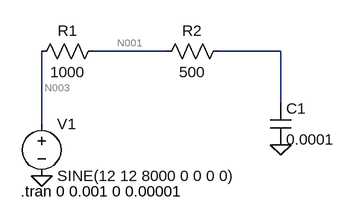
[diagram p0: schematic test_LV.asc]
test_LV.asc, the LTspice schematic file:
Version 4
SHEET 1 924 680
WIRE 464 -48 352 -48
WIRE 640 -48 544 -48
WIRE 640 32 640 -48
WIRE 272 64 272 -48
FLAG 640 96 0
FLAG 272 144 0
SYMBOL res 368 -64 R90
WINDOW 0 0 56 VBottom 2
WINDOW 3 32 56 VTop 2
SYMATTR InstName R1
SYMATTR Value 1000
SYMBOL res 560 -64 R90
WINDOW 0 0 56 VBottom 2
WINDOW 3 32 56 VTop 2
SYMATTR InstName R2
SYMATTR Value 500
SYMBOL cap 624 32 R0
SYMATTR InstName C1
SYMATTR Value 0.0001
SYMBOL voltage 272 48 R0
WINDOW 123 0 0 Left 0
WINDOW 39 0 0 Left 0
SYMATTR InstName V1
SYMATTR Value SINE(12 12 8000 0 0 0 0)
TEXT 240 168 Left 2 !.tran 0 0.001 0 0.00001

The netlist it stands for:
* test_LV.asc
R1 N001 N003 1000
R2 N002 N001 500
C1 N002 0 0.0001
V1 N003 0 SINE(12 12 8000 0 0 0 0)
.tran 0 0.001 0 0.00001
.backanno
.end

* Results of the author's LTspice run, read from the files saved beside the schematic
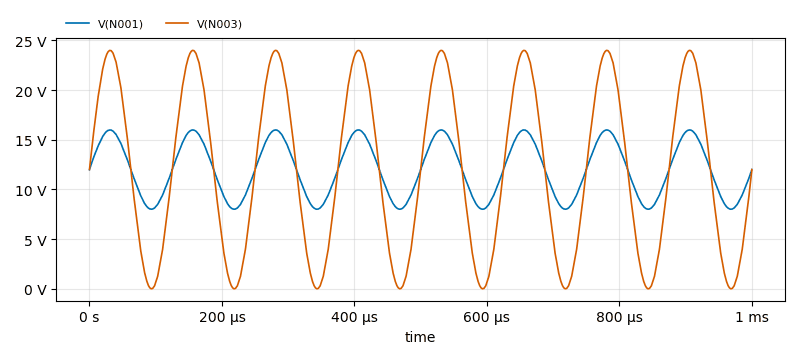
[diagram p1: Transient Analysis of test_LV.asc, plotted from the saved traces]
* Transient Analysis, 1 run:
*   V(N001): min 8.015 V, max 15.99 V, average 12 V, rms 12.33 V, last 12 V
*   V(N003): min 6.336 mV, max 23.99 V, average 12 V, rms 14.75 V, last 12 V